# Altium project ALU_ZF.PrjPcb
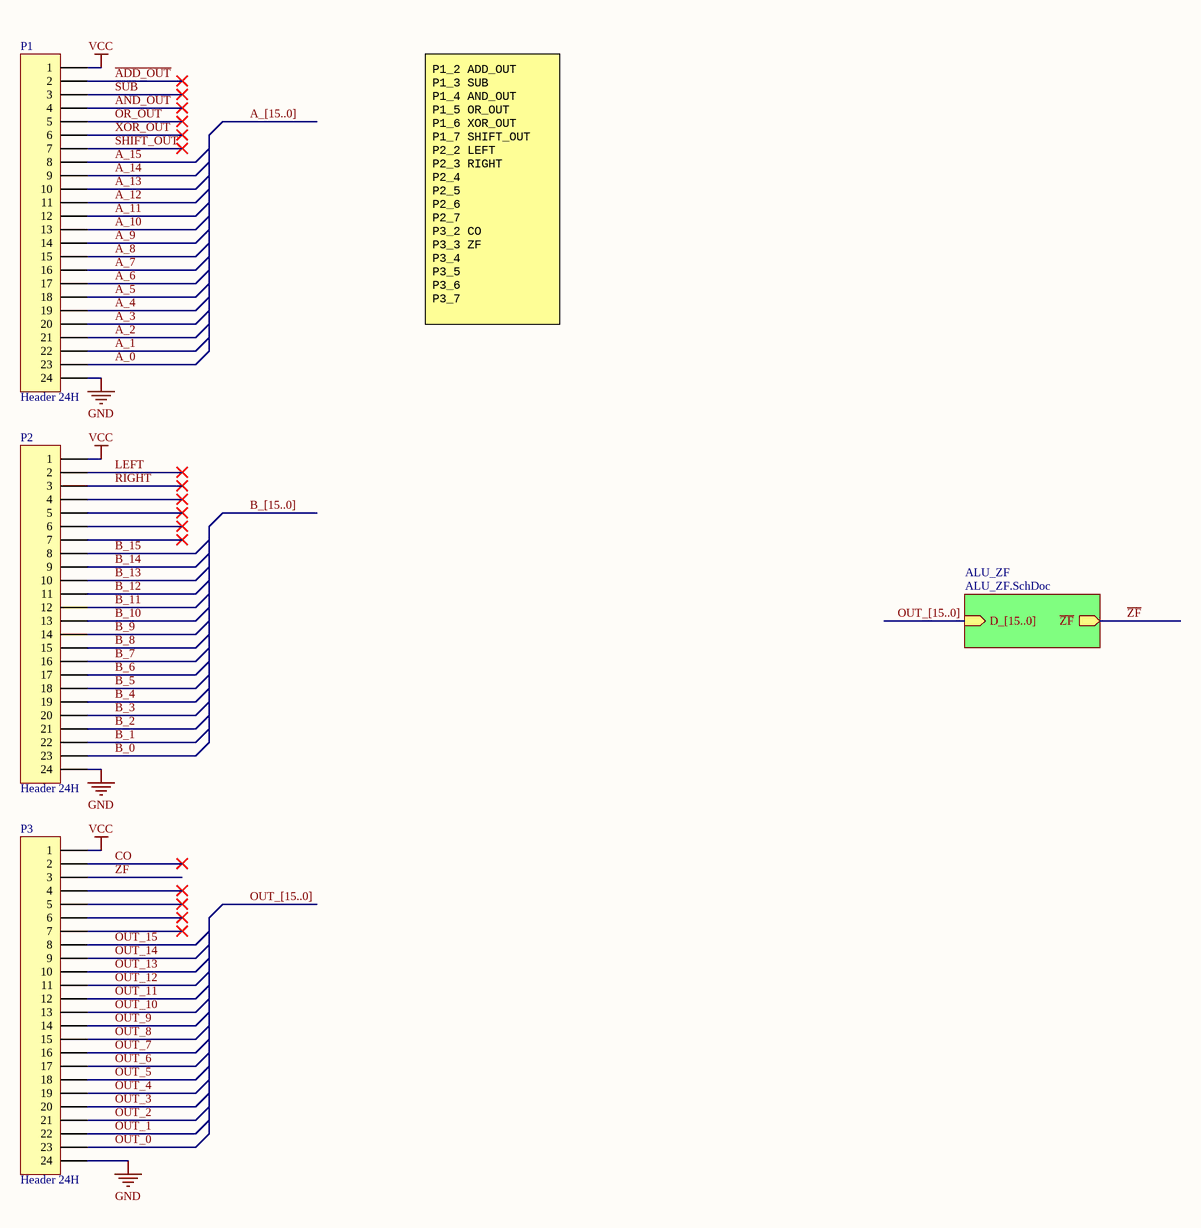
[diagram p0: Connectors.SchDoc]
2 sheets, 6 parts. Net scope: hierarchical (ports join the sheet entries above them; power ports are global).
Board file: ALU_ZF.PcbDoc
Sheets:
  Connectors.SchDoc
    ALU_ZF = ALU_ZF.SchDoc

## Sheet Connectors.SchDoc
size B; Author: E. Sims; Organization: Let's Build Rockets Inc.; SheetNumber: 1; SheetTotal: 2

### Parts
P1  Header 24H  [HDR1X24H]
P2  Header 24H  [HDR1X24H]
P3  Header 24H  [HDR1X24H]

### Sub-sheets
ALU_ZF = ALU_ZF.SchDoc: D_[15..0] (in), ~{ZF} (out)

### Nets
GND: P1.24 P2.24 P3.24
VCC: P1.1 P2.1 P3.1
~{ADD_OUT}: P1.2
~{AND_OUT}: P1.4
A_0: P1.23
A_1: P1.22
A_2: P1.21
A_3: P1.20
A_4: P1.19
A_5: P1.18
A_6: P1.17
A_7: P1.16
A_8: P1.15
A_9: P1.14
A_10: P1.13
A_11: P1.12
A_12: P1.11
A_13: P1.10
A_14: P1.9
A_15: P1.8
B_0: P2.23
B_1: P2.22
B_2: P2.21
B_3: P2.20
B_4: P2.19
B_5: P2.18
B_6: P2.17
B_7: P2.16
B_8: P2.15
B_9: P2.14
B_10: P2.13
B_11: P2.12
B_12: P2.11
B_13: P2.10
B_14: P2.9
B_15: P2.8
CO: P3.2
LEFT: P2.2
~{OR_OUT}: P1.5
OUT_0: P3.23
OUT_1: P3.22
OUT_2: P3.21
OUT_3: P3.20
OUT_4: P3.19
OUT_5: P3.18
OUT_6: P3.17
OUT_7: P3.16
OUT_8: P3.15
OUT_9: P3.14
OUT_10: P3.13
OUT_11: P3.12
OUT_12: P3.11
OUT_13: P3.10
OUT_14: P3.9
OUT_15: P3.8
RIGHT: P2.3
~{SHIFT_OUT}: P1.7
SUB: P1.3
~{XOR_OUT}: P1.6
~{ZF}: P3.3 ; sheet ALU_ZF/~{ZF}

Not connected (* = marked no-connect by the designer): P2 4* 5* 6* 7*; P3 4* 5* 6* 7*

### Buses and harness runs
bus A_[15..0]
bus B_[15..0]
bus OUT_[15..0]
bus OUT_[15..0] = sheet ALU_ZF/D_[15..0]

### Notes on the sheet
- P1_2 ADD_OUT
  P1_3 SUB
  P1_4 AND_OUT
  P1_5 OR_OUT
  P1_6 XOR_OUT
  P1_7 SHIFT_OUT
  P2_2 LEFT
  P2_3 RIGHT
  P2_4
  P2_5
  P2_6
  P2_7
  P3_2 CO
  P3_3 ZF
  P3_4
  P3_5
  P3_6
  P3_7
- Let's Build Rocket's Inc. Modular Paylaod System Based on TMP-010 Rev
  For more information visit https://github.com/LetsBuildRockets/Modular-Payload-System
  This work is licensed under CC BY-NC 4.0. To view a copy of this license, visit https://creativecommons.org/licenses/by-nc/4.0
- Title
- Size:
- Date:
- Assembly Variant:
- B
- Number:
- Time:
- Revision:
- Sheet
- of
- Author:
- File:

### Library data of the parts
P1-P3 = Header 24H: Header, 24-Pin, Right Angle; LatestRevisionDate: 17-Jul-2002; LatestRevisionNote: Re-released for DXP Platform.; Publisher: Altium Limited

## Sheet ALU_ZF.SchDoc
size B; Author: E. Sims; Organization: Let's Build Rockets Inc.; SheetNumber: 16; SheetTotal: 16
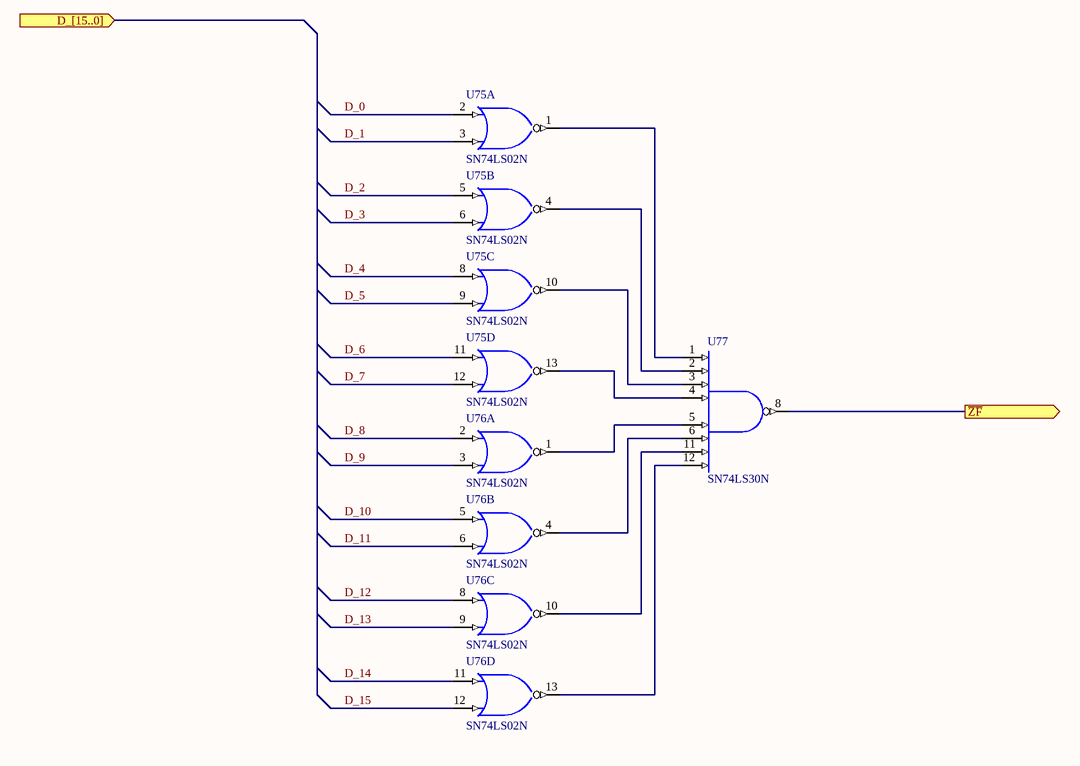
[diagram p1: ALU_ZF.SchDoc]

### Parts
U75  SN74LS02N  [N014]  (parts A,B,C,D of 4)
U76  SN74LS02N  [N014]  (parts A,B,C,D of 4)
U77  SN74LS30N  [N014]

### Ports
D_[15..0] (in), ~{ZF} (out)

### Nets
GND: U75.7(GND) U76.7(GND) U77.7(GND)
VCC: U75.14(VCC) U76.14(VCC) U77.14(VCC)
D_0: U75.2(A)
D_1: U75.3(B)
D_2: U75.5(A)
D_3: U75.6(B)
D_4: U75.8(A)
D_5: U75.9(B)
D_6: U75.11(A)
D_7: U75.12(B)
D_8: U76.2(A)
D_9: U76.3(B)
D_10: U76.5(A)
D_11: U76.6(B)
D_12: U76.8(A)
D_13: U76.9(B)
D_14: U76.11(A)
D_15: U76.12(B)
~{ZF}: U77.8(Y) ; port ~{ZF}
NetU75_1: U75.1(Y) U77.1(A)
NetU75_4: U75.4(Y) U77.2(B)
NetU75_10: U75.10(Y) U77.3(C)
NetU75_13: U75.13(Y) U77.4(D)
NetU76_1: U76.1(Y) U77.5(E)
NetU76_4: U76.4(Y) U77.6(F)
NetU76_10: U76.10(Y) U77.11(G)
NetU76_13: U76.13(Y) U77.12(H)

### Notes on the sheet
- Let's Build Rocket's Inc. Modular Paylaod System Based on TMP-010 Rev
  For more information visit https://github.com/LetsBuildRockets/Modular-Payload-System
  This work is licensed under CC BY-NC 4.0. To view a copy of this license, visit https://creativecommons.org/licenses/by-nc/4.0
- Title
- Size:
- Date:
- Assembly Variant:
- B
- Number:
- Time:
- Revision:
- Sheet
- of
- Author:
- File:

### Library data of the parts
U75 U76 = SN74LS02N: Quadruple 2-Input Positive-NOR Gate; Published: 8-Jun-2000; LatestRevisionDate: 04-Mar-2005; LatestRevisionNote: Stylized 3D Model Added.; DatasheetVersion: Mar-1988; PackageVersion: Oct-1995; PackageReference: N014; Publisher: Altium Limited; PackageDescription: DIP; 14 Leads; Row Spacing 7.62 mm; Pitch 2.54 mm; ComponentLink1Description: Manufacturer Link; ComponentLink1URL: http://www.ti.com/; ComponentLink2Description: Datasheet; ComponentLink2URL: http://www-s.ti.com/sc/ds/sn54s02.pdf
U77 = SN74LS30N: 8-Input Positive-NAND Gate; Note: Pins 9, 10  and 13 are NC & not drawn.; Published: 8-Jun-2000; LatestRevisionDate: 04-Mar-2005; LatestRevisionNote: Stylized 3D Model Added.; DatasheetVersion: Mar-1988; PackageVersion: Oct-1995; PackageReference: N014; Publisher: Altium Limited; PackageDescription: DIP; 14 Leads; Row Spacing 7.62 mm; Pitch 2.54 mm; ComponentLink1Description: Manufacturer Link; ComponentLink1URL: http://www.ti.com/; ComponentLink2Description: Datasheet; ComponentLink2URL: http://www-s.ti.com/sc/ds/sn74s30.pdf

## Nets that join several sheets
GND: Connectors (P1.24 P2.24 P3.24), ALU_ZF (U75.7 U76.7 U77.7)
VCC: Connectors (P1.1 P2.1 P3.1), ALU_ZF (U75.14 U76.14 U77.14)
~{ZF}: Connectors (P3.3), ALU_ZF (U77.8)